# Altium schematic sheet OSVentilatorV1.SchDoc: Open Source Ventilator
size B; DrawnBy: Chris Baird; Address1: Thief River Falls, MN; Address2: USA; Revision: 1; SheetNumber: 1; SheetTotal: 1
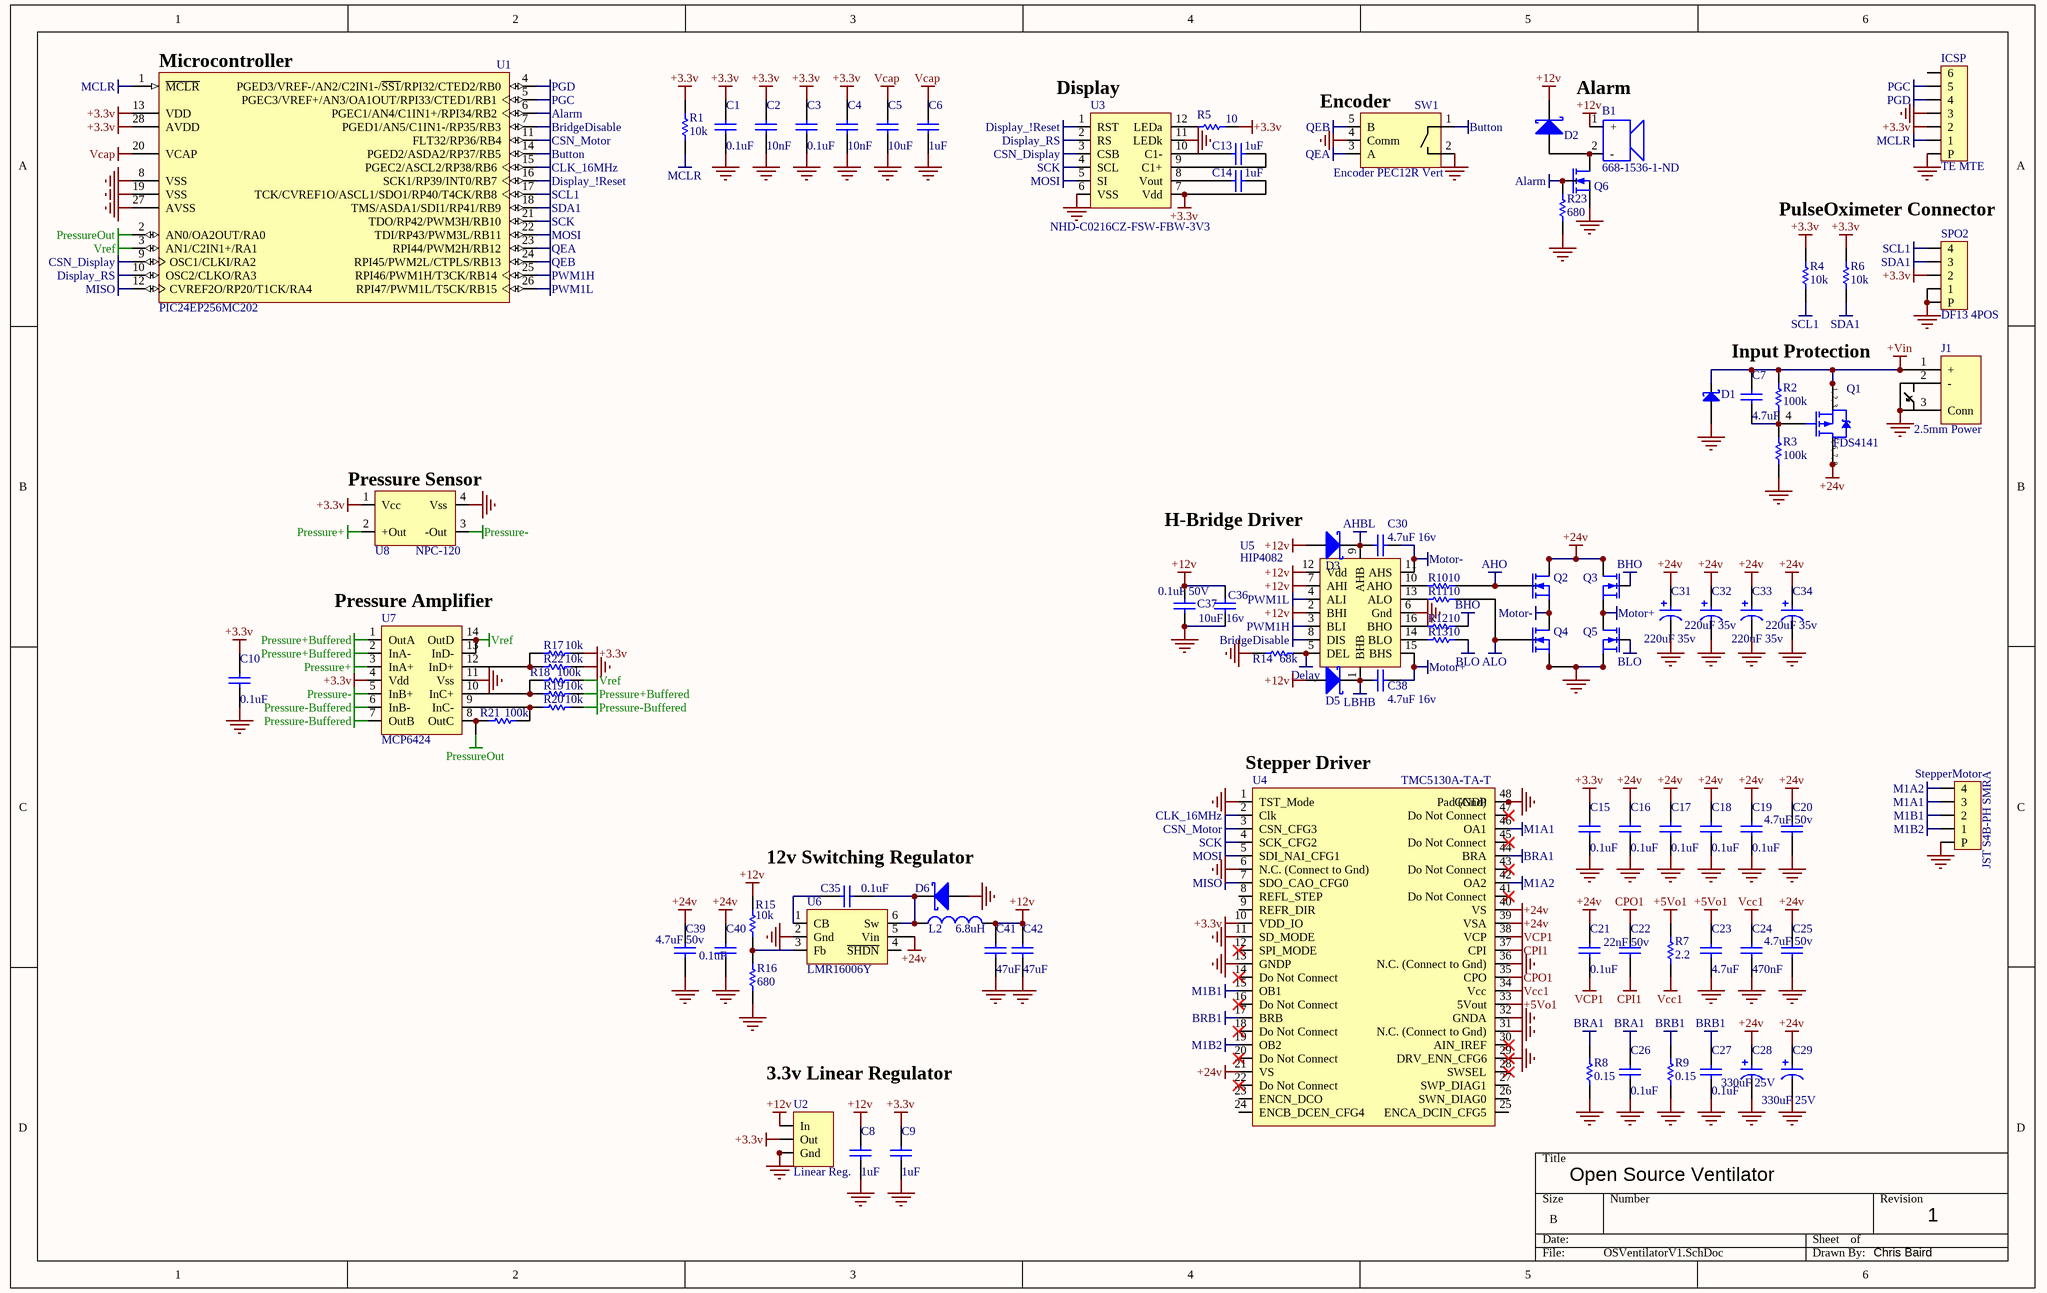
[diagram p0: OSVentilatorV1.SchDoc]

## Parts
B1  668-1536-1-ND  [Buzzer 9.6mm Square]
C1  value 0.1uF  [0603 Cap]  (hidden comment: CAP_0805)
C2  value 10nF  [0603 Cap]  (hidden comment: CAP_0805)
C3  value 0.1uF  [0603 Cap]  (hidden comment: CAP_0805)
C4  value 10nF  [0603 Cap]  (hidden comment: CAP_0805)
C5  value 10uF  [0603 Cap]  (hidden comment: CAP_0805)
C6  value 1uF  [0603]  (hidden comment: CAP_0805)
C7  value 4.7uF  [0603 Cap]  (hidden comment: CAP_0805)
C8  value 1uF  [0603]  (hidden comment: CAP_0805)
C9  value 1uF  [0603]  (hidden comment: CAP_0805)
C10  value 0.1uF  [0603]  (hidden comment: CAP_0805)
C13  value 1uF  [0603 Cap]  (hidden comment: CAP_0805)
C14  value 1uF  [0603 Cap]  (hidden comment: CAP_0805)
C15  value 0.1uF  [0603 Cap]  (hidden comment: CAP_0805)
C16  value 0.1uF  [0603 Cap]  (hidden comment: CAP_0805)
C17  value 0.1uF  [0603 Cap]  (hidden comment: CAP_0805)
C18  value 0.1uF  [0603 Cap]  (hidden comment: CAP_0805)
C19  value 0.1uF  [0603 Cap]  (hidden comment: CAP_0805)
C20  value 4.7uF 50v  [0805 Cap]  (hidden comment: CAP_0805)
C21  value 0.1uF  [0603 Cap]  (hidden comment: CAP_0805)
C22  value 22nF 50v  [0603 Cap]  (hidden comment: CAP_0805)
C23  value 4.7uF  [0603 Cap]  (hidden comment: CAP_0805)
C24  value 470nF  [0603 Cap]  (hidden comment: CAP_0805)
C25  value 4.7uF 50v  [0805 Cap]  (hidden comment: CAP_0805)
C26  value 0.1uF  [0603 Cap]  (hidden comment: CAP_0805)
C27  value 0.1uF  [0603 Cap]  (hidden comment: CAP_0805)
C28  value 330uF 25V  [Cap 8.3mm²]  (hidden comment: Capacitor Electrolytic)
C29  value 330uF 25V  [Cap 8.3mm²]  (hidden comment: Capacitor Electrolytic)
C30  value 4.7uF 16v  [0603 Cap]  (hidden comment: CAP_0805)
C31  value 220uF 35v  [Cap 6.6mm²]  (hidden comment: Capacitor Electrolytic)
C32  value 220uF 35v  [Cap 6.6mm²]  (hidden comment: Capacitor Electrolytic)
C33  value 220uF 35v  [Cap 6.6mm²]  (hidden comment: Capacitor Electrolytic)
C34  value 220uF 35v  [Cap 6.6mm²]  (hidden comment: Capacitor Electrolytic)
C35  value 0.1uF  [0603 Cap]  (hidden comment: CAP_0805)
C36  value 10uF 16v  [0805]  (hidden comment: CAP_0805)
C37  value 0.1uF 50V  [0603 Res]  (hidden comment: CAP_0805)
C38  value 4.7uF 16v  [0603 Cap]  (hidden comment: CAP_0805)
C39  value 4.7uF 50v  [1210 Cap]  (hidden comment: CAP_0805)
C40  value 0.1uF  [0805 Cap]  (hidden comment: CAP_0805)
C41  value 47uF  [1210 Cap]  (hidden comment: 311-2054-1-ND)
C42  value 47uF  [1210 Cap]  (hidden comment: 311-2054-1-ND)
D1  3.0SMCJ24ADICT-ND  [DSO-C2/X3.3]  (value not drawn)
D2  DB2W31800LCT-ND  [SOD123]  (value not drawn)
D3  DB2W31800LCT-ND  [SOD123]  (value not drawn)
D5  DB2W31800LCT-ND  [SOD123]  (value not drawn)
D6  DB2W31800LCT-ND  [SOD123]  (value not drawn)
ICSP  TE MTE  [TE MTE 6POS SMT RA]
J1  2.5mm Power  [Power Jack 2.5x5.5 SMD RA]
L2  value 6.8uH  [Inductor - 4mm²]  (hidden comment: 445-6553-1-ND)
Q1  FDS4141  [SOIC 8]
Q2  CSD18563Q5A  [VSONP-8]  (value not drawn)
Q3  CSD18563Q5A  [VSONP-8]  (value not drawn)
Q4  CSD18563Q5A  [VSONP-8]  (value not drawn)
Q5  CSD18563Q5A  [VSONP-8]  (value not drawn)
Q6  MOSFET Nch SO-23-6  [sot23-3]  (value not drawn)
R1  value 10k  [0603 Res]  (hidden comment: RES_0805)
R2  value 100k  [0603 Res]  (hidden comment: RES_0805)
R3  value 100k  [0603 Res]  (hidden comment: RES_0805)
R4  value 10k  [0603 Res]  (hidden comment: RES_0805)
R5  value 10  [0603 Res]  (hidden comment: RES_0805)
R6  value 10k  [0603 Res]  (hidden comment: RES_0805)
R7  value 2.2  [0603 Res]  (hidden comment: RES_0805)
R8  value 0.15  [1206 Res]  (hidden comment: RES_0805)
R9  value 0.15  [1206 Res]  (hidden comment: RES_0805)
R10  value 10  [0603 Res]  (hidden comment: RES_0805)
R11  value 10  [0603 Res]  (hidden comment: RES_0805)
R12  value 10  [0603 Res]  (hidden comment: RES_0805)
R13  value 10  [0603 Res]  (hidden comment: RES_0805)
R14  value 68k  [0603 Res]  (hidden comment: RES_0805)
R15  value 10k  [0603 Res]  (hidden comment: RES_0805)
R16  value 680  [0603 Res]  (hidden comment: RES_0805)
R17  value 10k  [0603 Res]  (hidden comment: RES_0805)
R18  value 100k  [0603 Res]  (hidden comment: RES_0805)
R19  value 10k  [0603 Res]  (hidden comment: RES_0805)
R20  value 10k  [0603 Res]  (hidden comment: RES_0805)
R21  value 100k  [0603 Res]  (hidden comment: RES_0805)
R22  value 10k  [0603 Res]  (hidden comment: RES_0805)
R23  value 680  [0603 Res]  (hidden comment: RES_0805)
SPO2  DF13 4POS  [DF13 4POS SMD RA]
StepperMotor  JST S4B-PH SMRA  [JST S4B-PH SMRA]
SW1  Encoder PEC12R Vert  [Encoder PEC12R Vert]
U1  PIC24EP256MC202  [SSOP-28]
U2  Linear Reg.  [SOT 223]
U3  NHD-C0216CZ-FSW-FBW-3V3  [LCD NHD-C0216CZ-FSW-FBW-3V3]
U4  TMC5130A-TA-T  [TQFP-48-EP 9mm TMC5130]
U5  HIP4082  [SOIC 16]
U6  LMR16006Y  [SOT23-6]
U7  MCP6424  [TSSOP-14]
U8  NPC-120  [Pressure Sensor NPC-120]

## Nets
+3.3v: C1.1 C2.1 C3.1 C4.1 C9.1 C10.1 C14.2 C15.1 ICSP.2 R1.1 R4.1 R5.2 R6.1 R17.2 SPO2.2 U1.13(VDD) U1.28(AVDD) U2.3(Out) U3.7(Vdd) U4.10(VDD_IO) U7.4(Vdd) U8.1(Vcc)
+5Vo1: C23.1 R7.1 U4.33(5Vout)
+12v: B1.1(+) C8.1 C36.2 C37.2 C41.1 C42.1 D2.2(A) D3.1(C) D5.1(C) L2.2 R15.2 U2.1(In) U5.2(BHI) U5.7(AHI) U5.12(Vdd)
+24v: C16.1 C17.1 C18.1 C19.1 C20.1 C21.1 C25.1 C28.1 C29.1 C31.1 C32.1 C33.1 C34.1 C39.1 C40.1 Q1.5(D) Q1.6(D) Q1.7(D) Q1.8(D) Q2.5(D) Q2.6(D) Q2.7(D) Q2.8(D) Q3.5(D) Q3.6(D) Q3.7(D) Q3.8(D) U4.21(VS) U4.39(VSA) U4.40(VS) U6.5(Vin)
+Vin: C7.1 D1.2(A) J1.1(+) Q1.1(S) Q1.2(S) Q1.3(S) R2.1
AHBL: C30.2 D3.2(A) U5.9(AHB)
AHO: Q2.4(G) R10.2
Alarm: Q6.1(G) R23.2 U1.6(PGEC1/AN4/C1IN1+/RPI34/RB2)
ALO: Q4.4(G) R11.2
BHO: Q3.4(G) R12.2
BLO: Q5.4(G) R13.2
BRA1: C26.1 R8.2 U4.44(BRA)
BRB1: C27.1 R9.2 U4.17(BRB)
BridgeDisable: U1.7(PGED1/AN5/C1IN1-/RP35/RB3) U5.8(DIS)
Button: SW1.1(Sw1) U1.14(PGED2/ASDA2/RP37/RB5)
CLK_16MHz: U1.15(PGEC2/ASCL2/RP38/RB6) U4.2(Clk)
CPI1: C22.2 U4.37(CPI)
CPO1: C22.1 U4.35(CPO)
CSN_Display: U1.9(OSC1/CLKI/RA2) U3.3(CSB)
CSN_Motor: U1.11(FLT32/RP36/RB4) U4.3(CSN_CFG3)
Delay: R14.2 U5.5(DEL)
Display_!Reset: U1.16(SCK1/RP39/INT0/RB7) U3.1(RST)
Display_RS: U1.10(OSC2/CLKO/RA3) U3.2(RS)
GND: C1.2 C2.2 C3.2 C4.2 C5.2 C6.2 C8.2 C9.2 C10.2 C15.2 C16.2 C17.2 C18.2 C19.2 C20.2 C23.2 C24.2 C25.2 C26.2 C27.2 C28.2 C29.2 C31.2 C32.2 C33.2 C34.2 C36.1 C37.1 C39.2 C40.2 C41.2 C42.2 D1.1(C) D6.1(C) ICSP.0(P) ICSP.3 J1.2(-) J1.3(Conn) Q4.1(S) Q4.2(S) Q4.3(S) Q5.1(S) Q5.2(S) Q5.3(S) Q6.3(S) R3.1 R8.1 R9.1 R14.1 R16.1 R22.2 R23.1 SPO2.0(P) SPO2.1 StepperMotor.0(P) SW1.2(Sw2) SW1.4(Comm) U1.8(VSS) U1.19(VSS) U1.27(AVSS) U2.2(Gnd) U2.4(Gnd) U3.6(VSS) U3.11(LEDk) U4.0(Pad_(Gnd)) U4.1(TST_Mode) U4.6(N.C._(Connect_to_Gnd)) U4.11(SD_MODE) U4.13(GNDP) U4.29(DRV_ENN_CFG6) U4.31(N.C._(Connect_to_Gnd)) U4.32(GNDA) U4.36(N.C._(Connect_to_Gnd)) U4.48(GNDP) U5.6(Gnd) U6.2(Gnd) U7.11(Vss) U8.4(Vss)
LBHB: C38.2 D5.2(A) U5.1(BHB)
M1A1: StepperMotor.3 U4.46(OA1)
M1A2: StepperMotor.4 U4.42(OA2)
M1B1: StepperMotor.2 U4.15(OB1)
M1B2: StepperMotor.1 U4.19(OB2)
MCLR: ICSP.1 R1.2 U1.1(~{MCLR})
MISO: U1.12(CVREF2O/RP20/T1CK/RA4) U4.7(SDO_CAO_CFG0)
MOSI: U1.22(TDI/RP43/PWM3L/RB11) U3.5(SI) U4.5(SDI_NAI_CFG1)
Motor+: C38.1 Q3.1(S) Q3.2(S) Q3.3(S) Q5.5(D) Q5.6(D) Q5.7(D) Q5.8(D) U5.15(BHS)
Motor-: C30.1 Q2.1(S) Q2.2(S) Q2.3(S) Q4.5(D) Q4.6(D) Q4.7(D) Q4.8(D) U5.11(AHS)
PGC: ICSP.5 U1.5(PGEC3/VREF+/AN3/OA1OUT/RPI33/CTED1/RB1)
PGD: ICSP.4 U1.4(PGED3/VREF-/AN2/C2IN1-/~{SS1}/RPI32/CTED2/RB0)
Pressure+: U7.3(InA+) U8.2(+Out)
Pressure+Buffered: R19.2 U7.1(OutA) U7.2(InA-)
Pressure-: U7.5(InB+) U8.3(-Out)
Pressure-Buffered: R20.2 U7.6(InB-) U7.7(OutB)
PressureOut: R21.1 U1.2(AN0/OA2OUT/RA0) U7.8(OutC)
PWM1H: U1.25(RPI46/PWM1H/T3CK/RB14) U5.3(BLI)
PWM1L: U1.26(RPI47/PWM1L/T5CK/RB15) U5.4(ALI)
QEA: SW1.3(A) U1.23(RPI44/PWM2H/RB12)
QEB: SW1.5(B) U1.24(RPI45/PWM2L/CTPLS/RB13)
SCK: U1.21(TDO/RP42/PWM3H/RB10) U3.4(SCL) U4.4(SCK_CFG2)
SCL1: R4.2 SPO2.4 U1.17(TCK/CVREF1O/ASCL1/SDO1/RP40/T4CK/RB8)
SDA1: R6.2 SPO2.3 U1.18(TMS/ASDA1/SDI1/RP41/RB9)
Vcap: C5.1 C6.1 U1.20(VCAP)
Vcc1: C24.1 R7.2 U4.34(Vcc)
VCP1: C21.2 U4.38(VCP)
Vref: R18.2 U1.3(AN1/C2IN1+/RA1) U7.13(InD-) U7.14(OutD)
NetB1_2: B1.2(-) D2.1(C) Q6.2(D)
NetC7_2: C7.2 Q1.4(G) R2.2 R3.2
NetC13_1: C13.1 U3.10(C1-)
NetC13_2: C13.2 U3.9(C1+)
NetC14_1: C14.1 U3.8(Vout)
NetC35_1: C35.1 U6.1(CB)
NetC35_2: C35.2 D6.2(A) L2.1 U6.6(Sw)
NetR5_1: R5.1 U3.12(LEDa)
NetR10_1: R10.1 U5.10(AHO)
NetR11_1: R11.1 U5.13(ALO)
NetR12_1: R12.1 U5.16(BHO)
NetR13_1: R13.1 U5.14(BLO)
NetR15_1: R15.1 R16.2 U6.3(Fb)
NetR17_1: R17.1 R22.1 U7.12(InD+)
NetR18_1: R18.1 R19.1 U7.10(InC+)
NetR20_1: R20.1 R21.2 U7.9(InC-)

Not connected (* = marked no-connect by the designer): ICSP 6; U4 8(REFL_STEP) 9(REFR_DIR) 12(SPI_MODE)* 14(Do_Not_Connect)* 16(Do_Not_Connect)* 18(Do_Not_Connect)* 20(Do_Not_Connect)* 22(Do_Not_Connect)* 23(ENCN_DCO) 24(ENCB_DCEN_CFG4) 25(ENCA_DCIN_CFG5) 26(SWN_DIAG0) 27(SWP_DIAG1) 28(SWSEL)* 30(AIN_IREF)* 41(Do_Not_Connect)* 43(Do_Not_Connect)* 45(Do_Not_Connect)* 47(Do_Not_Connect)*; U6 4(~{SHDN})

## Notes on the sheet
- (near U1) Microcontroller
- (near U3) Display
- Alarm
- (near SW1) Encoder
- PulseOximeter Connector
- Input Protection
- (near U8) Pressure Sensor
- H-Bridge Driver
- (near U7) Pressure Amplifier
- (near U4) Stepper Driver
- 12v Switching Regulator
- 3.3v Linear Regulator
- Open Source Ventilator
- 1
- Chris Baird
- (in symbol MOSFET P Ch SOIC) 1, 2, 3; 5, 6, 7, 8

## Library data of the parts
B1 = Buzzer: ManufacturerPartNumber: SMI-1027-TW-12V-R
C1-C6 C10 C30 C36-C38 = CAP_0805: 0805 SMT Cap
C7 C23 = CAP_0805: 0805 SMT Cap; ManufacturerPartNumber: GRM188R6YA475KE15D
C8 C9 = CAP_0805: 0805 SMT Cap; ManufacturerPartNumber: CC0603KRX7R9BB105
C13 C14 C40 = CAP_0805: 0805 SMT Cap; ManufacturerPartNumber: CC0805KKX7R9BB105
C15-C19 C21 C26 C27 C35 = CAP_0805: 0805 SMT Cap; ManufacturerPartNumber: CC0603KRX7R9BB104
C20 C25 = CAP_0805: 0805 SMT Cap; ManufacturerPartNumber: GRM21BR61H475KE51L
C22 = CAP_0805: 0805 SMT Cap; ManufacturerPartNumber: CGA3E2X7R2A223K080AA
C24 = CAP_0805: 0805 SMT Cap; ManufacturerPartNumber: CL10A474KB8NNNC
C28 C29 = Capacitor Electrolytic: 493-6384-1-ND; ManufacturerPartNumber: EEE-FK1E331P
C31-C34 = Capacitor Electrolytic: 493-6384-1-ND; Manufacturer: Generic Components; Class I: Passive; Published: 8-Jun-2000; Revision: July-2002: Re-released for DXP Platform.; Publisher: Altium Limited; Class II: Capacitor
C39 = CAP_0805: 0805 SMT Cap; ManufacturerPartNumber: CL32B475KBJVPNE
C41 C42 = CAP_0805: 0805 SMT Cap; ManufacturerPartNumber: CL32A476KOJNNNE
D1 = Diode Schottky (SMC): TVS Diode; ManufacturerPartNumber: SMLJ24CA-Q
D2 D3 D5 D6 = D Schottky: ManufacturerPartNumber: DB2W31800L
ICSP = DF13 6POS: ManufacturerPartNumber: 5-147278-5
J1 = 2.5mm Power: 2.5mm Power Jack with Switch; Manufacturer: Generic Components; Class I: Connector; Revision: July-2002: Re-released for DXP Platform.; Publisher: Altium Limited
L2 = Inductor: Inductor Large 22uH; ManufacturerPartNumber: VLCF4028T-6R8N1R3-2
Q1 = MOSFET P Ch SOIC: ManufacturerPartNumber: FDS4141
Q2-Q5 = MOSFET N-ch 8-pin: No Description Available; Manufacturer_Part_Number: CSD18563Q5A
Q6 = MOSFET Nch SO-23-6: IRLML6346TRPBFCT-ND; pin to pad: 2>3 3>2; ManufacturerPartNumber: IRLML0030TRPBF
R1 R4 R6 R10-R14 = RES_0805: 0805 SMT Resistor
R2 R3 = RES_0805: 0805 SMT Resistor; ManufacturerPartNumber: RC0603FR-07100KL
R5 = RES_0805: 0805 SMT Resistor; ManufacturerPartNumber: RC0603FR-0710R0L
R7 = RES_0805: 0805 SMT Resistor; ManufacturerPartNumber: RC0603FR-072R2L
R8 R9 = RES_0805: 0805 SMT Resistor; ManufacturerPartNumber: RL1206FR-7W0R15L
R15 = RES_0805: 0805 SMT Resistor; ManufacturerPartNumber: RC0603FR-0754K9L
R16 R23 = RES_0805: 0805 SMT Resistor; ManufacturerPartNumber: RC0603FR-0710KL
R17-R22 = RES_0805: 0805 SMT Resistor; ManufacturerPartNumber: RC0603FR-0749R9L
StepperMotor = DF13 4POS: ManufacturerPartNumber: S4B-PH-SM4-TB(LF)(SN)
SW1 = Encoder w/Switch: ManufacturerPartNumber: PEC12R-4225F-S0024
U1 = PIC24EPxxxMC202
U2 = Linear Regulator: LM2937; ManufacturerPartNumber: LM2937IMP-3.3/NOPB
U3 = LCD NHD-C0216CZ-FSW-FBW-3V3: ManfuacturerPartNumber: NHD-C0216CZ-FSW-FBW-3V3
U4 = Stepper Driver TMC5130: ManufacturerPartNumber: TMC5130A-TA-T
U5 = H-Bridge Driver: Intersil HIP4082
U6 = Sw Reg Buck LMR16006Y: IC REG BUCK ADJ 0.6A 6SOT; ManufacturerPartNumber: LMR16006YDDCR
U7 = Op-Amp Quad: Quad Op-Amp
U8 = Pressure Sensor NPC-120: Amphenol SMT Medical Pressure Sensor